# Altium project RadioTransceiverBoard.PrjPcb (part 2 of 3)

## Sheet usb_controller.SchDoc
size 381 x 228 mm; SheetNumber: 12; SheetTotal: 17
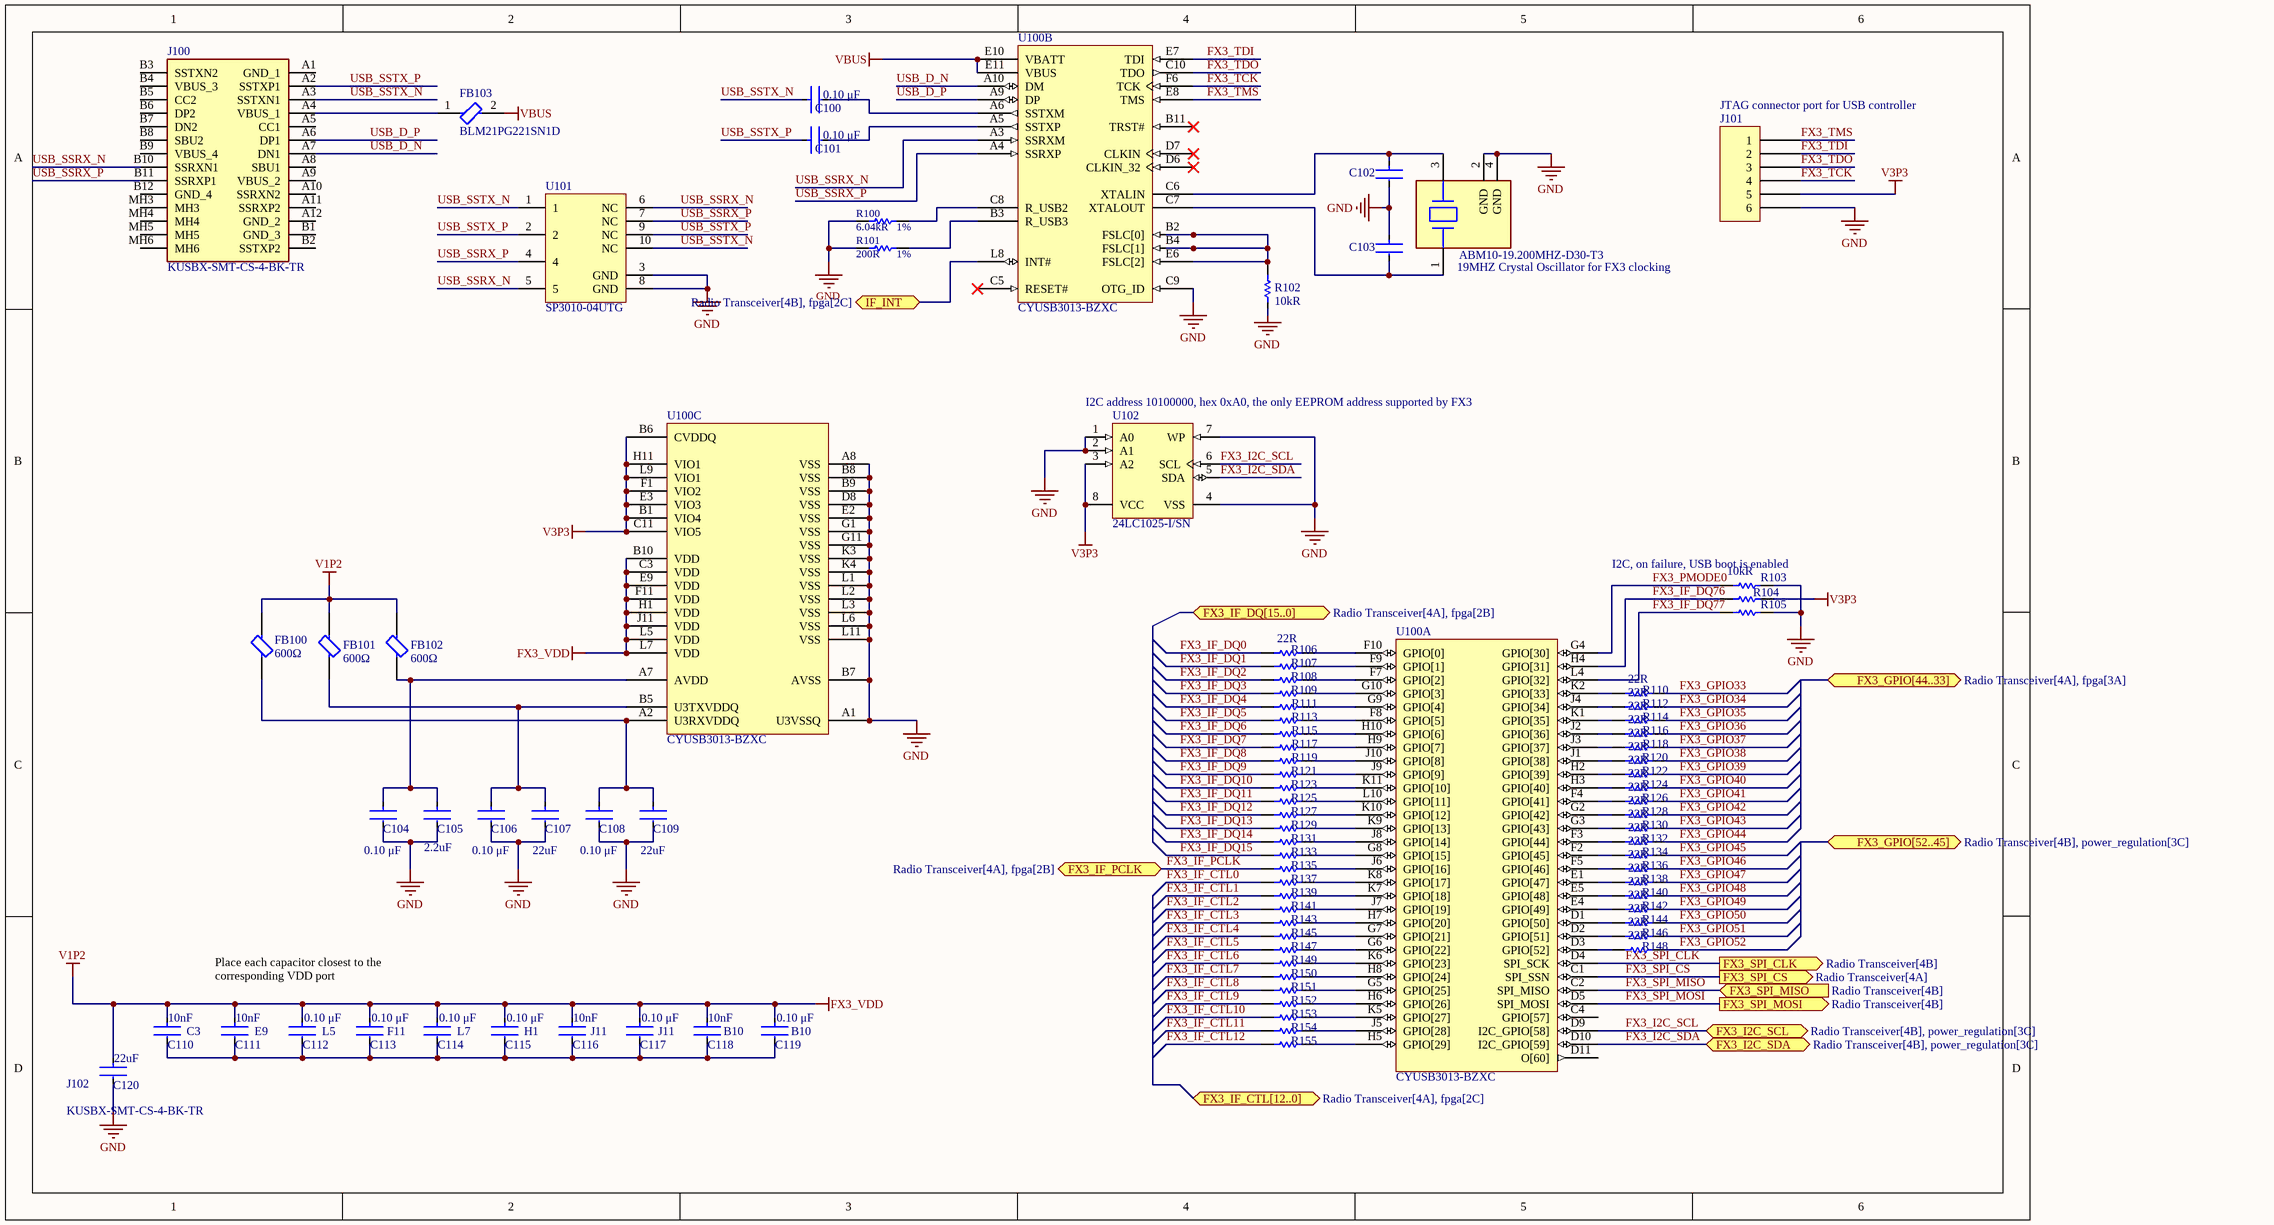
[diagram p5: usb_controller.SchDoc]

### Parts
C100  Capacitance: 0.10 μF  [FP-C0603C-CF-MFG]  (hidden comment: C0603C104K5RACTU)
C101  Capacitance: 0.10 μF  [FP-C0603C-CF-MFG]  (hidden comment: C0603C104K5RACTU)
C102  C0603C130J5GACTU  [FP-C0603C-CF-MFG]  (value not drawn)
C103  C0603C130J5GACTU  [FP-C0603C-CF-MFG]  (value not drawn)
C104  Capacitance: 0.10 μF  [FP-C0603C-CF-MFG]
C105  Capacitance: 2.2uF  [FP-0603-L_1_6_0_15-W_0_81-IPC_B]  (hidden comment: 06036C225KAT2A)
C106  Capacitance: 0.10 μF  [FP-C0603C-CF-MFG]
C107  Capacitance: 22uF  [FP-GRM21B-0_15-MFG]  (hidden comment: GRM21BR60J226ME39L)
C108  Capacitance: 0.10 μF  [FP-C0603C-CF-MFG]
C109  Capacitance: 22uF  [FP-GRM21B-0_15-MFG]  (hidden comment: GRM21BR60J226ME39L)
C110  C3  Capacitance: 10nF  [FP-GRM155-0_05-IPC_C]
C111  E9  Capacitance: 10nF  [FP-GRM155-0_05-IPC_C]
C112  L5  Capacitance: 0.10 μF  [FP-C0603C-CF-MFG]
C113  F11  Capacitance: 0.10 μF  [FP-C0603C-CF-MFG]
C114  L7  Capacitance: 0.10 μF  [FP-C0603C-CF-MFG]
C115  H1  Capacitance: 0.10 μF  [FP-C0603C-CF-MFG]
C116  J11  Capacitance: 10nF  [FP-GRM155-0_05-IPC_C]
C117  J11  Capacitance: 0.10 μF  [FP-C0603C-CF-MFG]
C118  B10  Capacitance: 10nF  [FP-GRM155-0_05-IPC_C]
C119  B10  Capacitance: 0.10 μF  [FP-C0603C-CF-MFG]
C120  Capacitance: 22uF  [FP-GRM21B-0_15-MFG]  (hidden comment: GRM21BR60J226ME39L)
FB100  Impedance: 600Ω  [FP-MPZ2012-MFG]  (hidden comment: MPZ2012S601AT000)
FB101  Impedance: 600Ω  [FP-MPZ2012-MFG]  (hidden comment: MPZ2012S601AT000)
FB102  Impedance: 600Ω  [FP-MPZ2012-MFG]  (hidden comment: MPZ2012S601AT000)
FB103  BLM21PG221SN1D  [FP-BLM21-0_2-t0_85-e0_5-IPC_B]
FX100  ABM10-19.200MHZ-D30-T3  [FP-ABM10-MFG]
J100  KUSBX-SMT-CS-4-BK-TR  [KUSBXSMTCS4BKTR]
J101  JTAG connector port for USB controller  [SULLINS NPPN061BFCN]
J102  KUSBX-SMT-CS-4-BK-TR  [KUSBXSMTCS4BKTR]
R100  value 6.04kR  Resistance Tolerance: 1%  [RESC3216X70X50LL05T20]  (hidden comment: ERJ-8ENF6041V)
R101  value 200R  Resistance Tolerance: 1%  [RESC3216X70X50LL05T20]  (hidden comment: ERJ-8ENF2000V)
R102  value 10kR  [RESC1005X40X25ML05T05]  (hidden comment: ERJ-2GEJ103X)
R103  ERJ-2GEJ103X  [RESC1005X40X25ML05T05]  (value not drawn)
R104  value 10kR  [RESC1005X40X25ML05T05]  (hidden comment: ERJ-2GEJ103X)
R105  ERJ-2GEJ103X  [RESC1005X40X25ML05T05]  (value not drawn)
R106  value 22R  [RESC0603X26X15ML03T05]  (hidden comment: ERJ1GNF22R0C)
R107  ERJ1GNF22R0C  [RESC0603X26X15ML03T05]  (value not drawn)
R108  ERJ1GNF22R0C  [RESC0603X26X15ML03T05]  (value not drawn)
R109  ERJ1GNF22R0C  [RESC0603X26X15ML03T05]  (value not drawn)
R110  value 22R  [RESC0603X26X15ML03T05]  (hidden comment: ERJ1GNF22R0C)
R111  ERJ1GNF22R0C  [RESC0603X26X15ML03T05]  (value not drawn)
R112  value 22R  [RESC0603X26X15ML03T05]  (hidden comment: ERJ1GNF22R0C)
R113  ERJ1GNF22R0C  [RESC0603X26X15ML03T05]  (value not drawn)
R114  value 22R  [RESC0603X26X15ML03T05]  (hidden comment: ERJ1GNF22R0C)
R115  ERJ1GNF22R0C  [RESC0603X26X15ML03T05]  (value not drawn)
R116  value 22R  [RESC0603X26X15ML03T05]  (hidden comment: ERJ1GNF22R0C)
R117  ERJ1GNF22R0C  [RESC0603X26X15ML03T05]  (value not drawn)
R118  value 22R  [RESC0603X26X15ML03T05]  (hidden comment: ERJ1GNF22R0C)
R119  ERJ1GNF22R0C  [RESC0603X26X15ML03T05]  (value not drawn)
R120  value 22R  [RESC0603X26X15ML03T05]  (hidden comment: ERJ1GNF22R0C)
R121  ERJ1GNF22R0C  [RESC0603X26X15ML03T05]  (value not drawn)
R122  value 22R  [RESC0603X26X15ML03T05]  (hidden comment: ERJ1GNF22R0C)
R123  ERJ1GNF22R0C  [RESC0603X26X15ML03T05]  (value not drawn)
R124  value 22R  [RESC0603X26X15ML03T05]  (hidden comment: ERJ1GNF22R0C)
R125  ERJ1GNF22R0C  [RESC0603X26X15ML03T05]  (value not drawn)
R126  value 22R  [RESC0603X26X15ML03T05]  (hidden comment: ERJ1GNF22R0C)
R127  ERJ1GNF22R0C  [RESC0603X26X15ML03T05]  (value not drawn)
R128  value 22R  [RESC0603X26X15ML03T05]  (hidden comment: ERJ1GNF22R0C)
R129  ERJ1GNF22R0C  [RESC0603X26X15ML03T05]  (value not drawn)
R130  value 22R  [RESC0603X26X15ML03T05]  (hidden comment: ERJ1GNF22R0C)
R131  ERJ1GNF22R0C  [RESC0603X26X15ML03T05]  (value not drawn)
R132  value 22R  [RESC0603X26X15ML03T05]  (hidden comment: ERJ1GNF22R0C)
R133  ERJ1GNF22R0C  [RESC0603X26X15ML03T05]  (value not drawn)
R134  value 22R  [RESC0603X26X15ML03T05]  (hidden comment: ERJ1GNF22R0C)
R135  ERJ1GNF22R0C  [RESC0603X26X15ML03T05]  (value not drawn)
R136  value 22R  [RESC0603X26X15ML03T05]  (hidden comment: ERJ1GNF22R0C)
R137  ERJ1GNF22R0C  [RESC0603X26X15ML03T05]  (value not drawn)
R138  value 22R  [RESC0603X26X15ML03T05]  (hidden comment: ERJ1GNF22R0C)
R139  ERJ1GNF22R0C  [RESC0603X26X15ML03T05]  (value not drawn)
R140  value 22R  [RESC0603X26X15ML03T05]  (hidden comment: ERJ1GNF22R0C)
R141  ERJ1GNF22R0C  [RESC0603X26X15ML03T05]  (value not drawn)
R142  value 22R  [RESC0603X26X15ML03T05]  (hidden comment: ERJ1GNF22R0C)
R143  ERJ1GNF22R0C  [RESC0603X26X15ML03T05]  (value not drawn)
R144  value 22R  [RESC0603X26X15ML03T05]  (hidden comment: ERJ1GNF22R0C)
R145  ERJ1GNF22R0C  [RESC0603X26X15ML03T05]  (value not drawn)
R146  value 22R  [RESC0603X26X15ML03T05]  (hidden comment: ERJ1GNF22R0C)
R147  ERJ1GNF22R0C  [RESC0603X26X15ML03T05]  (value not drawn)
R148  value 22R  [RESC0603X26X15ML03T05]  (hidden comment: ERJ1GNF22R0C)
R149  ERJ1GNF22R0C  [RESC0603X26X15ML03T05]  (value not drawn)
R150  ERJ1GNF22R0C  [RESC0603X26X15ML03T05]  (value not drawn)
R151  ERJ1GNF22R0C  [RESC0603X26X15ML03T05]  (value not drawn)
R152  ERJ1GNF22R0C  [RESC0603X26X15ML03T05]  (value not drawn)
R153  ERJ1GNF22R0C  [RESC0603X26X15ML03T05]  (value not drawn)
R154  ERJ1GNF22R0C  [RESC0603X26X15ML03T05]  (value not drawn)
R155  ERJ1GNF22R0C  [RESC0603X26X15ML03T05]  (value not drawn)
U100  CYUSB3013-BZXC  [CYP-BZX121]  (parts A,B,C of 3)
U101  SP3010-04UTG  [LFUS-uDFN-10_V]
U102  24LC1025-I/SN  [SOIC-SN8_L]

### Ports
FX3_GPIO[44..33] (bidir, see Radio Transceiver[4A], fpga[3A]), FX3_GPIO[52..45] (bidir, see Radio Transceiver[4B], power_regulation[3C]), FX3_I2C_SCL (bidir, see Radio Transceiver[4B], power_regulation[3C]), FX3_I2C_SDA (bidir, see Radio Transceiver[4B], power_regulation[3C]), FX3_IF_CTL[12..0] (bidir, see Radio Transceiver[4A], fpga[2C]), FX3_IF_DQ[15..0] (bidir, see Radio Transceiver[4A], fpga[2B]), FX3_IF_PCLK (bidir, see Radio Transceiver[4A], fpga[2B]), FX3_SPI_CLK (out, see Radio Transceiver[4B]), FX3_SPI_CS (out, see Radio Transceiver[4A]), FX3_SPI_MISO (in, see Radio Transceiver[4B]), FX3_SPI_MOSI (out, see Radio Transceiver[4B]), IF_INT (bidir, see Radio Transceiver[4B], fpga[2C])

### Nets
FX3_VDD: C110.1 C111.1 C112.1 C113.1 C114.1 C115.1 C116.1 C117.1 C118.1 C119.1 C120.1 FB100.2 FB101.2 FB102.2 U100.B10(VDD) U100.C3(VDD) U100.E9(VDD) U100.F11(VDD) U100.H1(VDD) U100.J11(VDD) U100.L5(VDD) U100.L7(VDD)  [also labelled V1P2]
GND: C102.2 C103.1 C104.2 C105.2 C106.2 C107.2 C108.2 C109.2 C120.2 FX100.2(GND) FX100.4(GND) J101.6 R100.1 R101.1 R102.1 R103.2 R105.2 U100.A1(U3VSSQ) U100.A8(VSS) U100.B7(AVSS) U100.B8(VSS) U100.B9(VSS) U100.C9(OTG_ID) U100.D8(VSS) U100.E2(VSS) U100.G1(VSS) U100.G11(VSS) U100.K3(VSS) U100.K4(VSS) U100.L1(VSS) U100.L2(VSS) U100.L3(VSS) U100.L6(VSS) U100.L11(VSS) U101.3(GND) U101.8(GND) U102.1(A0) U102.2(A1) U102.4(VSS) U102.7(WP)
V3P3: J101.5 R104.2 U100.B1(VIO4) U100.B6(CVDDQ) U100.C11(VIO5) U100.E3(VIO3) U100.F1(VIO2) U100.H11(VIO1) U100.L9(VIO1) U102.3(A2) U102.8(VCC)
VBUS: FB103.2 U100.E10(VBATT) U100.E11(VBUS)
FX3_GPIO33: R110.2
FX3_GPIO34: R112.2
FX3_GPIO35: R114.2
FX3_GPIO36: R116.2
FX3_GPIO37: R118.2
FX3_GPIO38: R120.2
FX3_GPIO39: R122.2
FX3_GPIO40: R124.2
FX3_GPIO41: R126.2
FX3_GPIO42: R128.2
FX3_GPIO43: R130.2
FX3_GPIO44: R132.2
FX3_GPIO45: R134.2
FX3_GPIO46: R136.2
FX3_GPIO47: R138.2
FX3_GPIO48: R140.2
FX3_GPIO49: R142.2
FX3_GPIO50: R144.2
FX3_GPIO51: R146.2
FX3_GPIO52: R148.2
FX3_I2C_SCL: U100.D9(I2C_GPIO[58]) U102.6(SCL) ; port FX3_I2C_SCL
FX3_I2C_SDA: U100.D10(I2C_GPIO[59]) U102.5(SDA) ; port FX3_I2C_SDA
FX3_IF_CTL0: R137.1
FX3_IF_CTL1: R139.1
FX3_IF_CTL2: R141.1
FX3_IF_CTL3: R143.1
FX3_IF_CTL4: R145.1
FX3_IF_CTL5: R147.1
FX3_IF_CTL6: R149.1
FX3_IF_CTL7: R150.1
FX3_IF_CTL8: R151.1
FX3_IF_CTL9: R152.1
FX3_IF_CTL10: R153.1
FX3_IF_CTL11: R154.1
FX3_IF_CTL12: R155.1
FX3_IF_DQ0: R106.1
FX3_IF_DQ1: R107.1
FX3_IF_DQ2: R108.1
FX3_IF_DQ3: R109.1
FX3_IF_DQ4: R111.1
FX3_IF_DQ5: R113.1
FX3_IF_DQ6: R115.1
FX3_IF_DQ7: R117.1
FX3_IF_DQ8: R119.1
FX3_IF_DQ9: R121.1
FX3_IF_DQ10: R123.1
FX3_IF_DQ11: R125.1
FX3_IF_DQ12: R127.1
FX3_IF_DQ13: R129.1
FX3_IF_DQ14: R131.1
FX3_IF_DQ15: R133.1
FX3_IF_DQ76: R104.1 U100.H4(GPIO[31])
FX3_IF_DQ77: R105.1 U100.L4(GPIO[32])
FX3_IF_PCLK: R135.1 ; port FX3_IF_PCLK
FX3_PMODE0: R103.1 U100.G4(GPIO[30])
FX3_SPI_CLK: U100.D4(SPI_SCK) ; port FX3_SPI_CLK
FX3_SPI_CS: U100.C1(SPI_SSN) ; port FX3_SPI_CS
FX3_SPI_MISO: U100.C2(SPI_MISO) ; port FX3_SPI_MISO
FX3_SPI_MOSI: U100.D5(SPI_MOSI) ; port FX3_SPI_MOSI
FX3_TCK: J101.4 U100.F6(TCK)
FX3_TDI: J101.2 U100.E7(TDI)
FX3_TDO: J101.3 U100.C10(TDO)
FX3_TMS: J101.1 U100.E8(TMS)
USB_D_N: J100.A7(DN1) U100.A10(DM)
USB_D_P: J100.A6(DP1) U100.A9(DP)
USB_SSRX_N: J100.B10(SSRXN1) U100.A3(SSRXM) U101.5 U101.6(NC)
USB_SSRX_P: J100.B11(SSRXP1) U100.A4(SSRXP) U101.4 U101.7(NC)
USB_SSTX_N: C100.1 J100.A3(SSTXN1) U101.1 U101.10(NC)
USB_SSTX_P: C101.1 J100.A2(SSTXP1) U101.2 U101.9(NC)
NetC100_2: C100.2 U100.A6(SSTXM)
NetC101_2: C101.2 U100.A5(SSTXP)
NetC102_1: C102.1 FX100.3 U100.C6(XTALIN)
NetC103_2: C103.2 FX100.1 U100.C7(XTALOUT)
NetC104_1: C104.1 C105.1 FB102.1 U100.A7(AVDD)
NetC106_1: C106.1 C107.1 FB101.1 U100.B5(U3TXVDDQ)
NetC108_1: C108.1 C109.1 FB100.1 U100.A2(U3RXVDDQ)
NetC110_2: C110.2 C111.2 C112.2 C113.2 C114.2 C115.2 C116.2 C117.2 C118.2 C119.2
NetFB103_1: FB103.1 J100.A4(VBUS_1)
NetIC201_P11: U100.L8(INT#) ; port IF_INT
NetR100_2: R100.2 U100.C8(R_USB2)
NetR101_2: R101.2 U100.B3(R_USB3)
NetR102_2: R102.2 U100.B2(FSLC[0]) U100.B4(FSLC[1]) U100.E6(FSLC[2])
NetR106_2: R106.2 U100.F10(GPIO[0])
NetR107_2: R107.2 U100.F9(GPIO[1])
NetR108_2: R108.2 U100.F7(GPIO[2])
NetR109_2: R109.2 U100.G10(GPIO[3])
NetR110_1: R110.1 U100.K2(GPIO[33])
NetR111_2: R111.2 U100.G9(GPIO[4])
NetR112_1: R112.1 U100.J4(GPIO[34])
NetR113_2: R113.2 U100.F8(GPIO[5])
NetR114_1: R114.1 U100.K1(GPIO[35])
NetR115_2: R115.2 U100.H10(GPIO[6])
NetR116_1: R116.1 U100.J2(GPIO[36])
NetR117_2: R117.2 U100.H9(GPIO[7])
NetR118_1: R118.1 U100.J3(GPIO[37])
NetR119_2: R119.2 U100.J10(GPIO[8])
NetR120_1: R120.1 U100.J1(GPIO[38])
NetR121_2: R121.2 U100.J9(GPIO[9])
NetR122_1: R122.1 U100.H2(GPIO[39])
NetR123_2: R123.2 U100.K11(GPIO[10])
NetR124_1: R124.1 U100.H3(GPIO[40])
NetR125_2: R125.2 U100.L10(GPIO[11])
NetR126_1: R126.1 U100.F4(GPIO[41])
NetR127_2: R127.2 U100.K10(GPIO[12])
NetR128_1: R128.1 U100.G2(GPIO[42])
NetR129_2: R129.2 U100.K9(GPIO[13])
NetR130_1: R130.1 U100.G3(GPIO[43])
NetR131_2: R131.2 U100.J8(GPIO[14])
NetR132_1: R132.1 U100.F3(GPIO[44])
NetR133_2: R133.2 U100.G8(GPIO[15])
NetR134_1: R134.1 U100.F2(GPIO[45])
NetR135_2: R135.2 U100.J6(GPIO[16])
NetR136_1: R136.1 U100.F5(GPIO[46])
NetR137_2: R137.2 U100.K8(GPIO[17])
NetR138_1: R138.1 U100.E1(GPIO[47])
NetR139_2: R139.2 U100.K7(GPIO[18])
NetR140_1: R140.1 U100.E5(GPIO[48])
NetR141_2: R141.2 U100.J7(GPIO[19])
NetR142_1: R142.1 U100.E4(GPIO[49])
NetR143_2: R143.2 U100.H7(GPIO[20])
NetR144_1: R144.1 U100.D1(GPIO[50])
NetR145_2: R145.2 U100.G7(GPIO[21])
NetR146_1: R146.1 U100.D2(GPIO[51])
NetR147_2: R147.2 U100.G6(GPIO[22])
NetR148_1: R148.1 U100.D3(GPIO[52])
NetR149_2: R149.2 U100.K6(GPIO[23])
NetR150_2: R150.2 U100.H8(GPIO[24])
NetR151_2: R151.2 U100.G5(GPIO[25])
NetR152_2: R152.2 U100.H6(GPIO[26])
NetR153_2: R153.2 U100.K5(GPIO[27])
NetR154_2: R154.2 U100.J5(GPIO[28])
NetR155_2: R155.2 U100.H5(GPIO[29])

Not connected (* = marked no-connect by the designer): J100 A1(GND_1) A5(CC1) A8(SBU1) A9(VBUS_2) A10(SSRXN2) A11(SSRXP2) A12(GND_2) B1(GND_3) B2(SSTXP2) B3(SSTXN2) B4(VBUS_3) B5(CC2) B6(DP2) B7(DN2) B8(SBU2) B9(VBUS_4) B12(GND_4) MH3 MH4 MH5 MH6; U100 A11(NC) B11(TRST#)* C4(GPIO[57]) C5(RESET#)* D6(CLKIN_32)* D7(CLKIN)* D11(O[60])

### Notes on the sheet
- (near FX100) 19MHZ Crystal Oscillator for FX3 clocking
- (near U102) I2C address 10100000, hex 0xA0, the only EEPROM address supported by FX3
- (near R103) I2C, on failure, USB boot is enabled
- Place each capacitor closest to the corresponding VDD port

### Library data of the parts
C100 C101 = CMP-2006-03061-2: CAP CER 0.1UF 50V X7R 0603; Manufacturer: KEMET; Tolerance: 0.1; Temperature Coefficient: 30ppm/°C; Material: Ceramic; Automotive Grade: Grade 1; Value: 0.10 μF; Temperature: -55°C to +125°C; RoHS: TRUE; Temperature Range High: +125°C; Lead Free: Yes; Octopart: https://octopart.com/c0603c104k5ractu-kemet-139244; Digikey Description: CAP CER 0.1UF 50V X7R 0603; Category: Cap; Package: C0603C-CF; ComponentLink2Description: Datasheet; Temperature Range Low: -55°C; Device Class L1: Passive Components; Voltage Rating: 50 V; Automotive: Yes; Device Class L3: Ceramic Capacitors; ComponentLink2URL: https://api.kemet.com/component-edge/download/datasheet/C0603C100J5GACAUTO.pdf; Device Class L2: Capacitors; Manufacturer Part Number: C0603C104K5RACTU; Temperature Characteristic: X7R; Height: 0.87mm
C102 C103 = CMP-1035-00648-3: CAP CER 13PF 50V NP0 0603; Manufacturer: KEMET; Material: Ceramic; Tolerance: 0.05; Temperature Coefficient: 30ppm/°C; Automotive Grade: Grade 1; Temperature Characteristic: C0G; Lead Free: Yes; Automotive: Yes; Capacitance: 13 pF; Value: 13 pF; Manufacturer Part Number: C0603C130J5GACTU; Mouser Description: Multilayer Ceramic Capacitor, C Series, 13 Pf, - 5%, C0g / Np0, 50 V, 0603 [1608 Metric] Rohs Compliant: Yes; Voltage Rating: 50 V; ComponentLink2URL: https://api.kemet.com/component-edge/download/datasheet/C0603C100J5GACAUTO.pdf; RoHS: TRUE; Temperature Range Low: -55°C; Octopart: https://octopart.com/c0603c130j5gactu-kemet-9139215; Device Class L1: Passive Components; Temperature: -55°C to +125°C; Package: C0603C-CF; ComponentLink2Description: Datasheet; Temperature Range High: +125°C; Device Class L2: Capacitors; Device Class L3: Ceramic Capacitors; Height: 0.87mm; Digikey Description: CAP CER 13PF 50V NP0 0603; Category: Cap
C104 C106 C108 C112-C115 C117 C119 = CMP-2006-03061-2: CAP CER 0.1UF 50V X7R 0603; Manufacturer: KEMET; Manufacturer Part Number: C0603C104K5RACTU; Tolerance: 0.1; Temperature Coefficient: 30ppm/°C; Material: Ceramic; Automotive Grade: Grade 1; Value: 0.10 μF; Temperature: -55°C to +125°C; RoHS: TRUE; Temperature Range High: +125°C; Lead Free: Yes; Octopart: https://octopart.com/c0603c104k5ractu-kemet-139244; Digikey Description: CAP CER 0.1UF 50V X7R 0603; Category: Cap; Package: C0603C-CF; ComponentLink2Description: Datasheet; Temperature Range Low: -55°C; Device Class L1: Passive Components; Voltage Rating: 50 V; Automotive: Yes; Device Class L3: Ceramic Capacitors; ComponentLink2URL: https://api.kemet.com/component-edge/download/datasheet/C0603C100J5GACAUTO.pdf; Device Class L2: Capacitors; Temperature Characteristic: X7R; Height: 0.87mm
C105 = CMP-2006-04473-2: General Purpose Ceramic Capacitor, 0603, 2.2uF, 10%, X7R, 15%, 6.3V; Dissipation Factor: 5%; Min Operating Temperature: -55°C; Dielectric: X7R; Depth: 0.81mm; Contact Plating: Tin; Termination: SMD/SMT; Voltage Rating (DC): 6.3V; RoHS Compliant: Yes; Case Code (Imperial): 0603; Lead Free: Lead Free; Packaging: Tape and Reel; Radiation Hardening: No; Max Operating Temperature: 125°C; Number of Pins: 2; Tolerance: 10%; Mount: Surface Mount; Construction: Flat; Package Quantity: 1; Case/Package: 0603; REACH SVHC: No SVHC; Length: 1.6mm; Case Code (Metric): 1608; Width: 0.032inch; Thickness: 0.035inch; Voltage: 6.3V; Height: 0.94mm; Voltage Rating: 6.3V; Series: -
C107 C109 C120 = CMP-2007-03385-2: Chip Multilayer Ceramic Capacitors for General Purpose, 0805, 22uF, X5R, 15%, 20%, 6.3V; Material: Ceramic; Max Operating Temperature: 85°C; Voltage: 6.3V; Min Operating Temperature: -55°C; Case/Package: 0805; Thickness: 0.053inch; Dielectric: X5R; Packaging: Tape and Reel; Depth: 1.25mm; Termination: SMD/SMT; Voltage Rating (DC): 6.3V; Radiation Hardening: No; Tolerance: 20%; Mount: Surface Mount; Lead Free: Lead Free; Package Quantity: 1; REACH SVHC: No SVHC; Voltage Rating: 6.3V; Length: 2mm; Case Code (Imperial): 0805; Case Code (Metric): 2012; Width: 0.049inch; Height: 1.25mm
C110 C111 C116 C118 = CMP-2008-04637-5: Chip Multilayer Ceramic Capacitors for General Purpose, 0402, 10000pF, X7R, 15%, 10%, 50V; Voltage: 25V; Tolerance: 10%; Mount: Surface Mount; Lead Free: Lead Free; Radiation Hardening: No; Case Code (Imperial): 0402; REACH SVHC: No SVHC; Case/Package: 0402; Dielectric: X7R; Voltage Rating (DC): 50V; Max Operating Temperature: 125°C; Termination: SMD/SMT; Material: Ceramic; Width: 0.02inch; Package Quantity: 1; Voltage Rating: 50V; Thickness: 0.022inch; Packaging: Tape and Reel; Height: 0.5mm; Number of Pins: 2; Case Code (Metric): 1005; Min Operating Temperature: -55°C; Length: 1mm; Depth: 0.5mm
FB100-FB102 = CMP-2000-05401-2: Manufacturer Lifecycle Status: PRODUCTION; NexarPartId: 12090955; RMS Current (Irms): 2A; Test Frequency: 100MHz; Tolerance: 25%; Core Material: Ferrite; Series Resistance: 100mΩ; Packaging: Digi-Reel®; Length: 2mm; Min Operating Temperature: -55°C; Width: 1.25mm; Max Width: 1.45mm; Lead Free: Lead Free; Current Rating: 2A; Case Code (Imperial): 0805; Min Length: 1.8mm; Schedule B: 8504500000, 8504500000; REACH SVHC: No SVHC; Case Code (Metric): 2012; Max DC Current: 2A; Case/Package: 0805; Lifecycle Status: Production; Min Width: 1.05mm; Mount: Surface Mount; Height: 1.0414mm; Resistance: 100mΩ; DC Resistance (DCR): 100mΩ; Max Operating Temperature: 125°C; Max Length: 2.2mm; RoHS: Compliant
FB103 = CMP-0686-00610-3: Chip Ferrite Bead, 0805, 220Ω @ 100MHz, 0.045Ω, 25%, 2A; Number of Circuits: 1; Shielding: Unshielded; DC Resistance (DCR): 45mR; Impedance: 220R; Radiation Hardening: No; Material: Ferrite; Frequency: 100MHz; Width: 1.25mm; DC Current: 2A; Max DC Current: 2A; Number of Lines: 1; Package Quantity: 1; Case Code (Metric): 2012; Current Rating: 2A; Case/Package: 0805; Current: 2A; Military Standard: Not; Core Material: Ferrite; Depth: 1.25mm; Contact Plating: Tin; DC Resistance-Max: 45mR; Max Operating Temperature: 125°C; Length: 2mm; Max Current Rating: 2A; REACH SVHC: No SVHC; Termination: SMD/SMT; Min Operating Temperature: -55°C; Series: BLM21P; Test Frequency: 100MHz; Tolerance: 25%; Number of Pins: 2; RoHS Compliant: Yes; Height: 0.85mm; Packaging: Tape and Reel; Lead Free: Lead Free; Case Code (Imperial): 0805
FX100 = CMP-27762-005233-1: Crystal 19.2MHz ±20ppm 10pF SMD-4 2.5mm x 2mm; ESR (Equivalent Series Resistance): 150R; Frequency Stability: 30ppm; Case/Package: SMD/SMT; Package Quantity: 3000; Tolerance: 20ppm; Termination: SMD/SMT; Frequency: 19.2MHz; Frequency Tolerance: 20ppm; Packaging: Tape and Reel; Max Operating Temperature: 85°C; Height: 0.028inch; Load Capacitance: 10pF; REACH SVHC: No SVHC; Series: ABM10; Number of Pins: 4; Length: 2.5mm; Width: 0.079inch; Mount: Surface Mount; Min Operating Temperature: -40°C; Depth: 2mm
J100 J102 = KUSBX-SMT-CS-4-BK-TR: Connector; Manufacturer_Name: Kycon; Datasheet Link: https://www.kycon.com/Pub_Eng_Draw/KUSBX-SMT-CS-4-BK-xxTR.pdf; Height: 3.56mm; Manufacturer_Part_Number: KUSBX-SMT-CS-4-BK-TR; Mouser Part Number: 806-KUSBX-SMTCS4BKTR; Mouser Price/Stock: https://www.mouser.co.uk/ProductDetail/Kycon/KUSBX-SMT-CS-4-BK-TR?qs=vvQtp7zwQdMngGj1HUt%252BlA%3D%3D
J101 = NPPN061BFCN-RC: CONN HDR 6POS 0.079 GOLD PCB; Manufacturer: Sullins Connector Solutions; Connector Type: Header; Contact Length - Post: 0.094" (2.40mm); Current Rating (Amps): 2A; Material Flammability Rating: UL94 V-0; Number of Positions: 6; Number of Positions Loaded: All; Pitch - Mating: 0.079" (2.00mm); Style: Board to Board; Part Number: NPPN061BFCN-RC; ComponentLink1Description: Datasheet; ComponentLink1URL: https://drawings-pdf.s3.amazonaws.com/10483.pdf; ComponentLink2Description: DigiKey Link; ComponentLink2URL: https://www.digikey.com/en/products/detail/sullins-connector-solutions/NPPN061BFCN-RC/804808; Contact Finish - Mating: Gold; Contact Finish - Post: Gold; Contact Finish Thickness - Mating: Flash; Contact Type: Female Socket; Fastening Type: Push-Pull; Insulation Color: Black; Insulation Height: 0.173" (4.40mm); LastUpdated: 6/21/2022 2:43:22 PM; Lifecycle Status: Active; Minimum Order: 1; Mounting Type: Through Hole; Number of Rows: 1; Operating Temperature: -40°C ~ 105°C; Packaging: Tube; Part Status: Active; Price: 0.40; Series: -; Supplier 1: DigiKey; Supplier Part Number 1: S5751-06-ND; Termination: Solder
R100 = CMP-2003-00441-1: Manufacturer: Panasonic; Part Number: ERJ-8ENF6041V
R101 = CMP-2003-00194-1: Manufacturer: Panasonic; Part Number: ERJ-8ENF2000V
R102-R105 = CMP-2002-00433-1: Manufacturer: Panasonic; Part Number: ERJ-2GEJ103X
R106-R155 = CMP-2004-03488-1: Manufacturer: Panasonic; Part Number: ERJ1GNF22R0C
U100 = CMP-0967-00036-1: EZ-USB(R) FX3: SuperSpeed USB Controller, 512 KB, 60 I/Os, 0 to 70 degC, 121-Pin BGA (BZX121); Manufacturer: Cypress; Memory Size (KB): 512; CPU Core: ARM926 EJ-S; Min. Operating Voltage (V): 1.15; Memory Architecture: SRAM; No. of I/Os: 60; Max. Operating Voltage (V): 1.25; Code_JEDEC: PUB 95; ComponentLink1Description: Manufacturer URL; PackageDescription: 121-Ball FBGA, Body 10 x 10 mm, Pitch 0.8 mm; PackageVersion: Rev. *D; ComponentLink1URL: http://www.cypress.com/; DatasheetVersion: Rev. *O; PartNumber: CYUSB3013-BZXC; PackageReference: BZX121; Min. Operating Temp. (degreesC): 0; Max. Operating Temp. (degreesC): 70; ComponentLink3URL: http://www.cypress.com/?docID=45795; ComponentLink3Description: Package Specification; ComponentLink2URL: http://www.cypress.com/?docID=49087; ComponentLink2Description: Datasheet; RoHS: Pb-Free; Mounting Technology: Surface Mount
U101 = CMP-2000-07135-1: Low Capacitance ESD Protection, 6 V, 3 A, -40 to 125 degC, 10-Pin uDFN, RoHS, Tape and Reel; Cd - Diode Capacitance: 0.45pF; Peak Surge Current: 3A; Breakdown Voltage: 6V; Brand: Littelfuse; Polarity: Bidirectional; Number of Channels: 4Channel; Clamping Voltage: 12.3V; Packaging: Reel; Product Category: TVSDiodeArrays; Package Reference: uDFN-10; Package / Case: uDFN-10; Termination Style: SMD/SMT; Mounting Style: SMD/SMT; Minimum Operating Temperature: -55C; Mounting Technology: SurfaceMount; Width: 1mm; Tradename: SPA; Manufacturer: Littelfuse; Manufacturer URL: http://www.littelfuse.com/; Datasheet URL: http://www.littelfuse.com/~/media/electronics/datasheets/tvs_diode_arrays/littelfuse_tvs_diode_array_sp3010_datasheet.pdf.pdf; Height: 0.515mm; Package Description: 10-Pin Dual Flat Package, Body 2.5 x 1 mm, Pitch 0.5 mm; Length: 2.5mm; Type: LowCapacitanceESDProtection; RoHS: True; Working Voltage: 6V; Datasheet Version: 12/2013; Series: SP3010; Maximum Operating Temperature: +125C
U102 = CMP-0159-00339-1: 1 Mbit, 400kHz, 2.5V, 8-Pin SOIC 150mil, Industrial Temperature; PackageVersion: revBB, Aug-2009; PackageDescription: 8-Lead Plastic Small Outline (SN) - Narrow, 3.90mm Body [SOIC]; PackageReference: SOIC-SN8; Code_JEDEC: MS-012; DatasheetVersion: revF, Oct-2008; Code_IPC: SOIC127P600-8

## Sheet power_regulation.SchDoc
size 381 x 241 mm; SheetNumber: 17; SheetTotal: 17
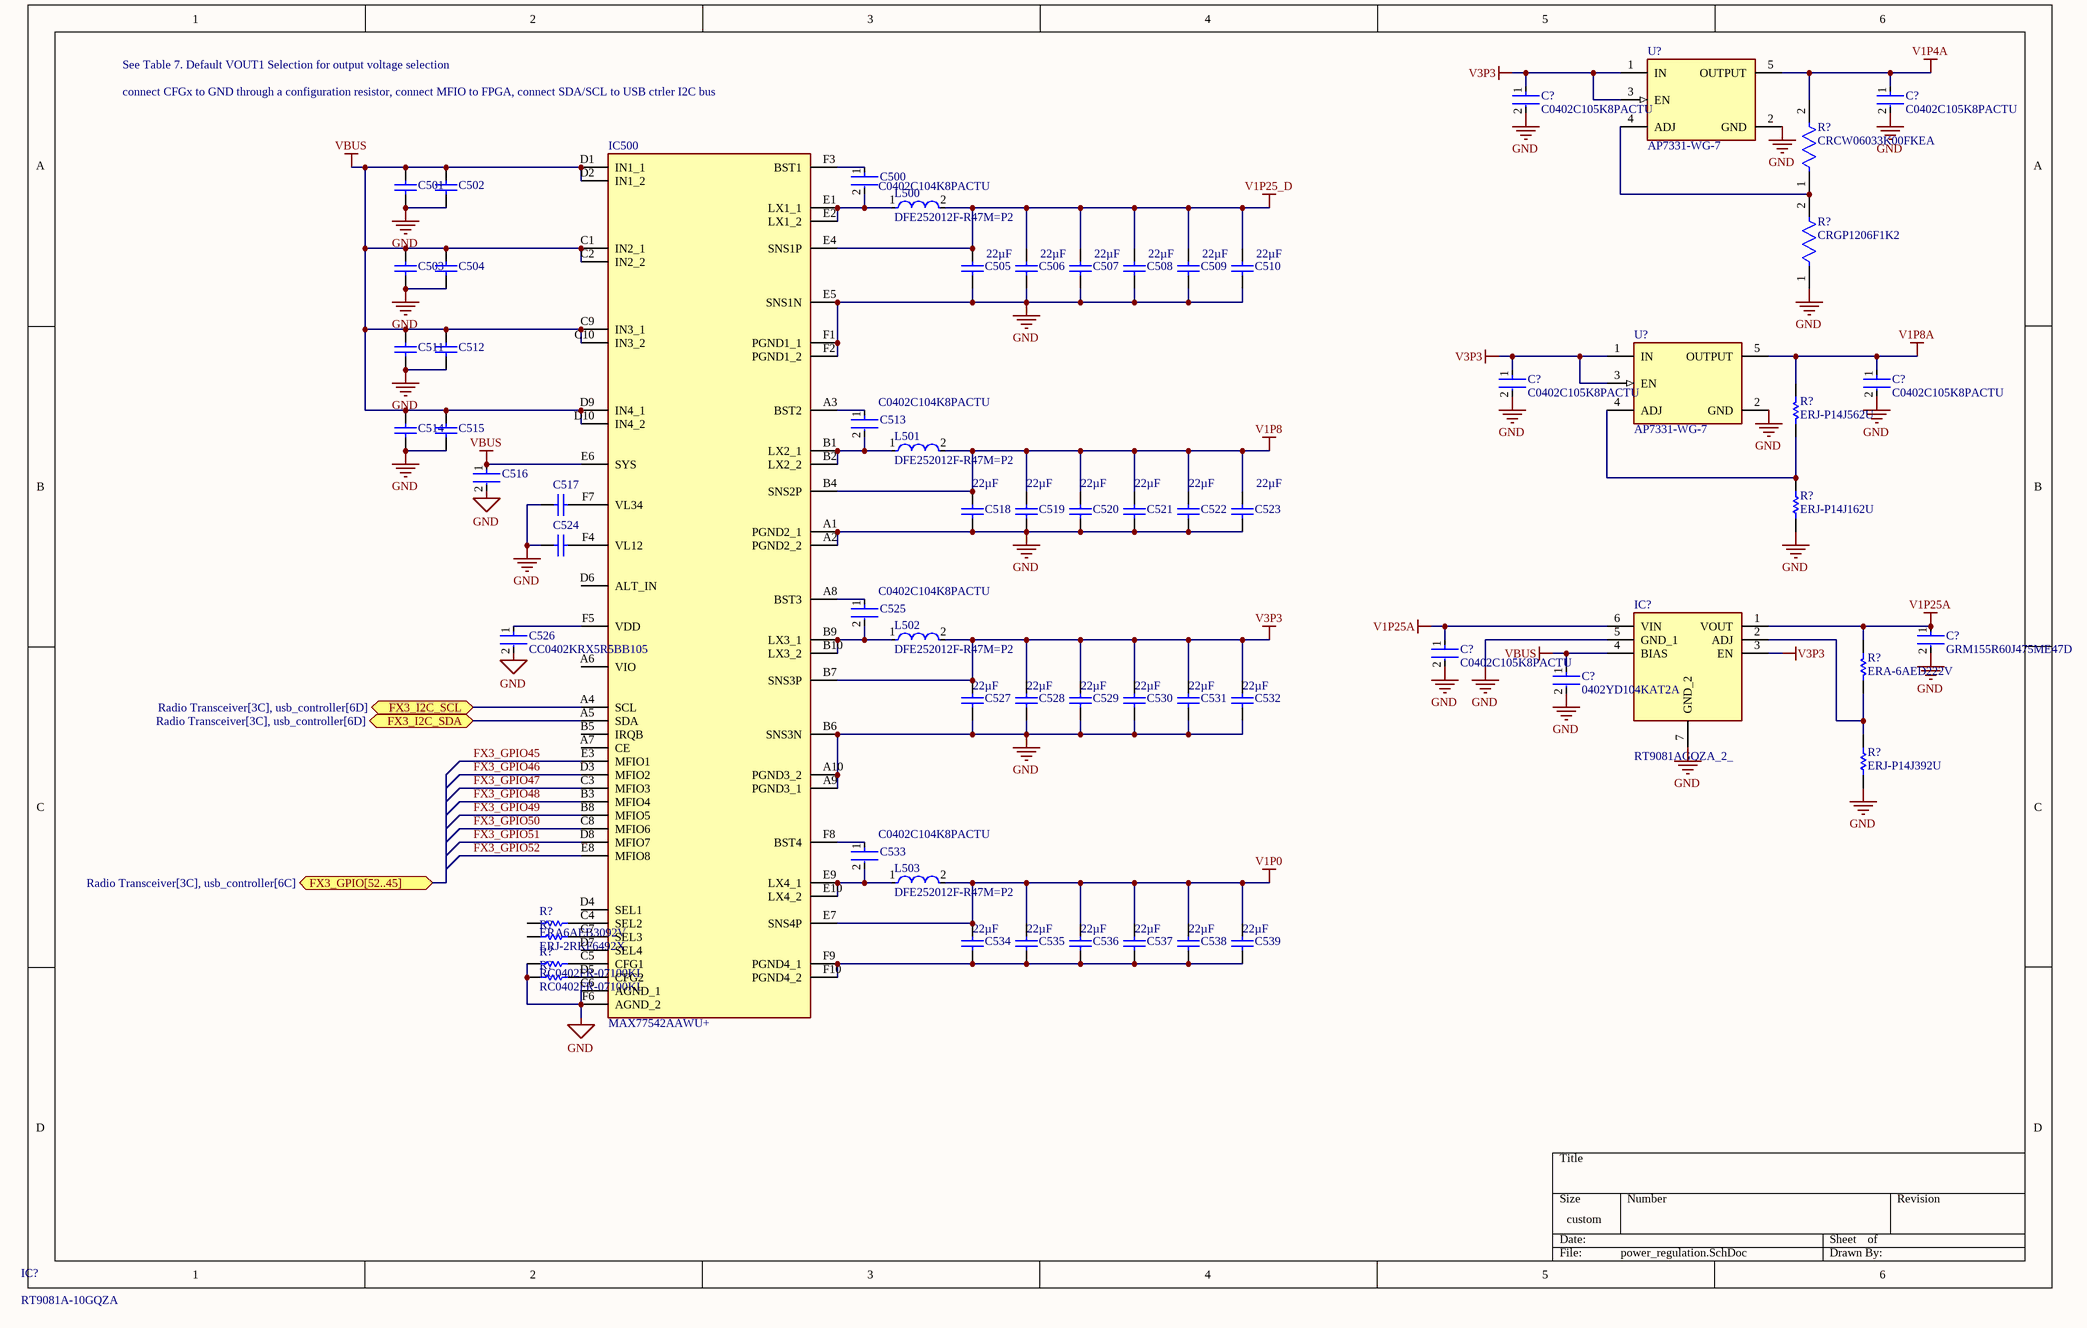
[diagram p6: power_regulation.SchDoc]

### Parts
(Parts that share a designator on the sheet are numbered #1, #2 ... from top to bottom, then left to right.)
C500  C0402C104K8PACTU  [FP-C0402-BB-MFG]
C501  C0603C105K3RACTU  [CAPC1608X87X35LL15T15]  (value not drawn)
C502  C0603C105K3RACTU  [CAPC1608X87X35LL15T15]  (value not drawn)
C503  C0603C105K3RACTU  [CAPC1608X87X35LL15T15]  (value not drawn)
C504  C0603C105K3RACTU  [CAPC1608X87X35LL15T15]  (value not drawn)
C505  Capacitance: 22µF  [CAPC1608X100X20ML10]  (hidden comment: C1608X5R1A226M080AC)
C506  Capacitance: 22µF  [CAPC1608X100X20ML10]  (hidden comment: C1608X5R1A226M080AC)
C507  Capacitance: 22µF  [CAPC1608X100X20ML10]  (hidden comment: C1608X5R1A226M080AC)
C508  Capacitance: 22µF  [CAPC1608X100X20ML10]  (hidden comment: C1608X5R1A226M080AC)
C509  Capacitance: 22µF  [CAPC1608X100X20ML10]  (hidden comment: C1608X5R1A226M080AC)
C510  Capacitance: 22µF  [CAPC1608X100X20ML10]  (hidden comment: C1608X5R1A226M080AC)
C511  C0603C105K3RACTU  [CAPC1608X87X35LL15T15]  (value not drawn)
C512  C0603C105K3RACTU  [CAPC1608X87X35LL15T15]  (value not drawn)
C513  C0402C104K8PACTU  [FP-C0402-BB-MFG]
C514  C0603C105K3RACTU  [CAPC1608X87X35LL15T15]  (value not drawn)
C515  C0603C105K3RACTU  [CAPC1608X87X35LL15T15]  (value not drawn)
C516  GRT155R61E225KE13D  [FP-GRT155-0_2-IPC_C]  (value not drawn)
C517  C0402C225K9PACTU  [CAPC1005X60X30NL05T10]  (value not drawn)
C518  Capacitance: 22µF  [CAPC1608X100X20ML10]  (hidden comment: C1608X5R1A226M080AC)
C519  Capacitance: 22µF  [CAPC1608X100X20ML10]  (hidden comment: C1608X5R1A226M080AC)
C520  Capacitance: 22µF  [CAPC1608X100X20ML10]  (hidden comment: C1608X5R1A226M080AC)
C521  Capacitance: 22µF  [CAPC1608X100X20ML10]  (hidden comment: C1608X5R1A226M080AC)
C522  Capacitance: 22µF  [CAPC1608X100X20ML10]  (hidden comment: C1608X5R1A226M080AC)
C523  Capacitance: 22µF  [CAPC1608X100X20ML10]  (hidden comment: C1608X5R1A226M080AC)
C524  C0402C225K9PACTU  [CAPC1005X60X30NL05T10]  (value not drawn)
C525  C0402C104K8PACTU  [FP-C0402-BB-MFG]
C526  CC0402KRX5R5BB105  [FP-CC0402-MFG]
C527  Capacitance: 22µF  [CAPC1608X100X20ML10]  (hidden comment: C1608X5R1A226M080AC)
C528  Capacitance: 22µF  [CAPC1608X100X20ML10]  (hidden comment: C1608X5R1A226M080AC)
C529  Capacitance: 22µF  [CAPC1608X100X20ML10]  (hidden comment: C1608X5R1A226M080AC)
C530  Capacitance: 22µF  [CAPC1608X100X20ML10]  (hidden comment: C1608X5R1A226M080AC)
C531  Capacitance: 22µF  [CAPC1608X100X20ML10]  (hidden comment: C1608X5R1A226M080AC)
C532  Capacitance: 22µF  [CAPC1608X100X20ML10]  (hidden comment: C1608X5R1A226M080AC)
C533  C0402C104K8PACTU  [FP-C0402-BB-MFG]
C534  Capacitance: 22µF  [CAPC1608X100X20ML10]  (hidden comment: C1608X5R1A226M080AC)
C535  Capacitance: 22µF  [CAPC1608X100X20ML10]  (hidden comment: C1608X5R1A226M080AC)
C536  Capacitance: 22µF  [CAPC1608X100X20ML10]  (hidden comment: C1608X5R1A226M080AC)
C537  Capacitance: 22µF  [CAPC1608X100X20ML10]  (hidden comment: C1608X5R1A226M080AC)
C538  Capacitance: 22µF  [CAPC1608X100X20ML10]  (hidden comment: C1608X5R1A226M080AC)
C539  Capacitance: 22µF  [CAPC1608X100X20ML10]  (hidden comment: C1608X5R1A226M080AC)
C?#1  C0402C105K8PACTU  [FP-C0402C105K8PACTU-MFG]
C?#2  C0402C105K8PACTU  [FP-C0402C105K8PACTU-MFG]
C?#3  C0402C105K8PACTU  [FP-C0402C105K8PACTU-MFG]
C?#4  C0402C105K8PACTU  [FP-C0402C105K8PACTU-MFG]
C?#5  GRM155R60J475ME47D  [FP-GRM155-0_1-IPC_B]
C?#6  C0402C105K8PACTU  [FP-C0402C105K8PACTU-MFG]
C?#7  0402YD104KAT2A  [FP-0402-L_1_0_1-W_0_5_0_1-IPC_B]
IC500  MAX77542AAWU+  [BGA60C40P10X6_436X256X69]
IC?#1  RT9081AGQZA_2_  [SON40P120X120X32-7N-D]
IC?#2  RT9081A-10GQZA  [SON40P120X120X32-7N-D]
L500  DFE252012F-R47M=P2  [FP-DFE252012C-MFG]
L501  DFE252012F-R47M=P2  [FP-DFE252012C-MFG]
L502  DFE252012F-R47M=P2  [FP-DFE252012C-MFG]
L503  DFE252012F-R47M=P2  [FP-DFE252012C-MFG]
R?#1  CRCW06033K00FKEA  [FP-CRCW0603-e3-MFG]
R?#2  CRGP1206F1K2  [FP-CRGP1206-IPC_C]
R?#3  ERJ-P14J562U  [RESC3225X70X50ML20T20]
R?#4  ERJ-P14J162U  [RESC3225X70X50NL20T20]
R?#5  ERA-6AED222V  [RESC2013X60X40NL20T25]
R?#6  ERJ-P14J392U  [RESC3225X70X50LL20T20]
R?#7  ERA6AEB3092V  [RESC2013X60X40NL20T25]
R?#8  ERJ-2RKF6492X  [RESC1005X40X25ML05T05]
R?#9  RC0402FR-07100KL  [RESC1005X40X25NL05T10]
R?#10  RC0402FR-07100KL  [RESC1005X40X25NL05T10]
U?#1  AP7331-WG-7  [FP-SOT25-MFG]
U?#2  AP7331-WG-7  [FP-SOT25-MFG]

### Ports
FX3_GPIO[52..45] (bidir, see Radio Transceiver[3C], usb_controller[6C]), FX3_I2C_SCL (bidir, see Radio Transceiver[3C], usb_controller[6D]), FX3_I2C_SDA (bidir, see Radio Transceiver[3C], usb_controller[6D])

### Nets
GND: C501.1 C502.1 C503.1 C504.1 C505.1 C506.1 C507.1 C508.1 C509.1 C510.1 C511.1 C512.1 C514.1 C515.1 C516.2 C517.1 C518.1 C519.1 C520.1 C521.1 C522.1 C523.1 C524.1 C526.2 C527.1 C528.1 C529.1 C530.1 C531.1 C532.1 C?#1.2 C?#2.2 C?#3.2 C?#4.2 C?#5.2 C?#6.2 C?#7.2 IC500.A1(PGND2_1) IC500.A2(PGND2_2) IC500.A9(PGND3_1) IC500.A10(PGND3_2) IC500.B6(SNS3N) IC500.C6(AGND_1) IC500.E5(SNS1N) IC500.F1(PGND1_1) IC500.F2(PGND1_2) IC500.F6(AGND_2) IC?#1.5(GND_1) IC?#1.7(GND_2) R?#2.1 R?#4.1 R?#6.1 R?#9.1 R?#10.1 U?#1.2(GND) U?#2.2(GND)
V1P0: C534.2 C535.2 C536.2 C537.2 C538.2 C539.2 IC500.E7(SNS4P) L503.2
V1P4A: C?#2.1 R?#1.2 U?#1.5(OUTPUT)
V1P8: C518.2 C519.2 C520.2 C521.2 C522.2 C523.2 IC500.B4(SNS2P) L501.2
V1P8A: C?#4.1 R?#3.1 U?#2.5(OUTPUT)
V1P25_D: C505.2 C506.2 C507.2 C508.2 C509.2 C510.2 IC500.E4(SNS1P) L500.2  [project net Vin_C_1P25D]
V1P25A: C?#5.1 C?#6.1 IC?#1.1(VOUT) IC?#1.6(VIN) R?#5.1  [project net Vin_B_1P25A]
V3P3: C527.2 C528.2 C529.2 C530.2 C531.2 C532.2 C?#1.1 C?#3.1 IC500.B7(SNS3P) IC?#1.3(EN) L502.2 U?#1.1(IN) U?#1.3(EN) U?#2.1(IN) U?#2.3(EN)
VBUS: C501.2 C502.2 C503.2 C504.2 C511.2 C512.2 C514.2 C515.2 C516.1 C?#7.1 IC500.C1(IN2_1) IC500.C2(IN2_2) IC500.C9(IN3_1) IC500.C10(IN3_2) IC500.D1(IN1_1) IC500.D2(IN1_2) IC500.D9(IN4_1) IC500.D10(IN4_2) IC500.E6(SYS) IC?#1.4(BIAS)
FX3_GPIO45: IC500.E3(MFIO1)
FX3_GPIO46: IC500.D3(MFIO2)
FX3_GPIO47: IC500.C3(MFIO3)
FX3_GPIO48: IC500.B3(MFIO4)
FX3_GPIO49: IC500.B8(MFIO5)
FX3_GPIO50: IC500.C8(MFIO6)
FX3_GPIO51: IC500.D8(MFIO7)
FX3_GPIO52: IC500.E8(MFIO8)
FX3_I2C_SCL: IC500.A4(SCL) ; port FX3_I2C_SCL
FX3_I2C_SDA: IC500.A5(SDA) ; port FX3_I2C_SDA
NetC500_1: C500.1 IC500.F3(BST1)
NetC500_2: C500.2 IC500.E1(LX1_1) IC500.E2(LX1_2) L500.1
NetC513_1: C513.1 IC500.A3(BST2)
NetC513_2: C513.2 IC500.B1(LX2_1) IC500.B2(LX2_2) L501.1
NetC517_2: C517.2 IC500.F7(VL34)
NetC524_2: C524.2 IC500.F4(VL12)
NetC525_1: C525.1 IC500.A8(BST3)
NetC525_2: C525.2 IC500.B9(LX3_1) IC500.B10(LX3_2) L502.1
NetC526_1: C526.1 IC500.F5(VDD)
NetC533_1: C533.1 IC500.F8(BST4)
NetC533_2: C533.2 IC500.E9(LX4_1) IC500.E10(LX4_2) L503.1
NetC534_1: C534.1 C535.1 C536.1 C537.1 C538.1 C539.1 IC500.F9(PGND4_1) IC500.F10(PGND4_2)
NetIC500_C4: IC500.C4(SEL2) R?#7.2
NetIC500_C5: IC500.C5(CFG1) R?#9.2
NetIC500_C7: IC500.C7(SEL3) R?#8.2
NetIC500_D5: IC500.D5(CFG2) R?#10.2
NetIC?#1_2: IC?#1.2(ADJ) R?#5.2 R?#6.2
NetR?#1_1: R?#1.1 R?#2.2 U?#1.4(ADJ)
NetR?#3_2: R?#3.2 R?#4.2 U?#2.4(ADJ)

Not connected (* = marked no-connect by the designer): IC500 A6(VIO) A7(CE) B5(IRQB) D4(SEL1) D6(ALT_IN) D7(SEL4); R?#7 1; R?#8 1

### Notes on the sheet
- connect CFGx to GND through a configuration resistor, connect MFIO to FPGA, connect SDA/SCL to USB ctrler I2C bus
- See Table 7. Default VOUT1 Selection for output voltage selection

### Library data of the parts
C500 = CMP-2008-02046-2: CAP CER 0.1UF 10V X5R 0402; Manufacturer: Kemet; Material: Ceramic; Capacitance: 0.10 μF; Temperature Coefficient: 15%; Tolerance: 0.1; Value: 1p; Package: C0402-BB; Temperature: -55°C to +125°C; ComponentLink2Description: Datasheet; Temperature Characteristic: X5R; Device Class L1: Passive Components; Height: 0.55mm; Lead Free: Yes; ComponentLink2URL: https://content.kemet.com/datasheets/KEM_C1002_X7R_SMD.pdf; Device Class L2: Capacitors; Temperature Range Low: -55°C; Temperature Range High: +125°C; RoHS: TRUE; Octopart: https://octopart.com/c0402c104k8pactu-kemet-140039; Automotive: No; Mouser Description: Capacitor 100 nF 10 VDC 0402; Category: Cap; Voltage Rating: 10 V; Digikey Description: CAP CER 0.1UF 10V X5R 0402; Ipc Land Pattern Name: CAPC10050X50; Device Class L3: Ceramic Capacitors; Manufacturer Part Number: C0402C104K8PACTU
C501-C504 C511 C512 C514 C515 = CMP-2006-03713-1: Manufacturer: Kemet; Part Number: C0603C105K3RACTU
C505-C510 C518-C523 C527-C532 C534-C539 = CMP-2000-05441-1: Chip Capacitor, 22 uF, +/- 20%, 10 V, -55 to 85 degC, 0603 (1608 Metric), RoHS, Tape and Reel; Manufacturer: TDK; PCN Part Number: MLCCPartNumberChange30/Nov/2012; Voltage - Rated: 10V; Product Training Modules: CSeriesGeneralApplicationsSEAT,CCV,andTVCLDesignToolsGuidetoReplacinganElectrolyticCapacitorwithanMLCC; Other Names: 445-9077-1; Design Resources: 20WNon-IsolatedBuckLEDDriverUsingPLLNK460KG; Online Catalog: CSeries,GeneralPurpose; Temperature Coefficient: X5R; Kits: 445-9014-KIT-ND-KITMLCC100PF-22UF060310-50V; Value: 22µF; Packaging: CutTape(CT); Standard Package: 1; Package / Case: 0603(1608Metric); Lead Style: -; Features: -; Ratings: -; Operating Temperature: -55degC~85degC; Applications: GeneralPurpose; Package Reference: 603; Datasheet URL: http://download.siliconexpert.com/pdfs/2015/4/21/15/54/45/779/tdk_/manual/37024850441143360mlcc_commercial_general_en.pdf; Datasheet Version: Mar-15; Mounting Type: SurfaceMount,MLCC; Lead Spacing: -; Size / Dimension: 0.063"Lx0.031"W(1.60mmx0.80mm); Height - Seated (Max): -; Package Description: 2-Pin Surface Mount Device, Body 1.6 x 0.8 mm; Manufacturer URL: http://www.tdk.com/; RoHS Information: RoHSCertificate-MLCC; Tolerance: ±20%; Series: C; Thickness (Max): 0.035"(0.90mm); Family: CeramicCapacitors; Category: Capacitors
C513 C525 C533 = CMP-2008-02046-2: CAP CER 0.1UF 10V X5R 0402; Manufacturer: Kemet; Material: Ceramic; Capacitance: 0.10 μF; Temperature Coefficient: 15%; Tolerance: 0.1; Value: 0.10 μF; Package: C0402-BB; Temperature: -55°C to +125°C; ComponentLink2Description: Datasheet; Temperature Characteristic: X5R; Device Class L1: Passive Components; Height: 0.55mm; Lead Free: Yes; ComponentLink2URL: https://content.kemet.com/datasheets/KEM_C1002_X7R_SMD.pdf; Device Class L2: Capacitors; Temperature Range Low: -55°C; Temperature Range High: +125°C; RoHS: TRUE; Octopart: https://octopart.com/c0402c104k8pactu-kemet-140039; Automotive: No; Mouser Description: Capacitor 100 nF 10 VDC 0402; Category: Cap; Voltage Rating: 10 V; Digikey Description: CAP CER 0.1UF 10V X5R 0402; Ipc Land Pattern Name: CAPC10050X50; Device Class L3: Ceramic Capacitors; Manufacturer Part Number: C0402C104K8PACTU
C516 = CMP-06035-059281-1: Multi-Layer Ceramic Capacitor 2.2uF 25V X5R ±10% 0402 Paper T/R; Max Operating Temperature: 85°C; Case Code (Imperial): 0402; Width: 0.02inch; Min Operating Temperature: -55°C; Voltage Rating (DC): 25V; Tolerance: 10%; Length: 0.039inch; Ratings: AEC-Q200; Dielectric: X5R; Case Code (Metric): 1005; Thickness: 0.022inch; Voltage Rating: 25V; Packaging: Cut Tape; Case/Package: 0402; Mount: Surface Mount; Capacitance: 2.2uF; Value: 2.2uF
C517 C524 = CMP-2008-02055-1: Manufacturer: Kemet; Part Number: C0402C225K9PACTU
C526 = CMP-2100-03591-2: CAP CER 1UF 6.3V X5R 0402; Manufacturer: YAGEO; Automotive Grade: NA; Material: Ceramic; Tolerance: 0.1; Temperature Coefficient: 30ppm/°C; Voltage Rating: 6.3 V; Temperature Range Low: -55°C; Digikey Description: CAP CER 1UF 6.3V X5R 0402; Capacitance: 1 uF; Height: 0.55mm; Automotive: No; ComponentLink2URL: http://www.yageo.com/documents/recent/UPY-GP_NP0_16V-to-50V_16.pdf; Device Class L2: Capacitors; RoHS: TRUE; Temperature Range High: +125°C; Device Class L3: Ceramic Capacitors; Device Class L1: Passive Components; Temperature Characteristic: X5R; Package: CC0402; Octopart: https://octopart.com/cc0402krx5r5bb105-yageo-42244618; ComponentLink2Description: Datasheet; Temperature: -55°C to +125°C; Manufacturer Part Number: CC0402KRX5R5BB105; Mouser Description: Multilayer Ceramic Capacitors MLCC - SMD/SMT 1uF 6.3V X5R 10%; Category: Cap; Footprint Url: http://www.yageo.com/exep/pages/download/literatures/UPY-C_GEN_24.pdf; Lead Free: Yes; Ipc Land Pattern Name: CAPC10050X50; Value: 1 uF
C?#1-C?#4 C?#6 = CMP-2008-02081-2: CAP CER 1UF 10V X5R 0402; Dielectric Material: Ceramic; Dissipation Factor: 5%; Tolerance: 10%; Number of Pins: 2; Contact Plating: Tin; Min Operating Temperature: -55°C; Termination: SMD/SMT; Lead Free: Lead Free; Construction: Flat; Voltage Rating (DC): 10V; Mount: Surface Mount; Series: C; Thickness: 0.022inch; Width: 0.5mm; Radiation Hardening: No; Capacitance: 1uF; Dielectric: X5R; Height: 0.5mm; Voltage: 10V; Length: 1mm; Depth: 0.5mm; Max Operating Temperature: 85°C; Package Quantity: 1; Packaging: Tape and Reel; RoHS Compliant: Yes; Case Code (Imperial): 0402; Case Code (Metric): 1005; REACH SVHC: No SVHC; Voltage Rating: 10V; Case/Package: 0402
C?#5 = CMP-2008-04549-2: Chip Multilayer Ceramic Capacitors for General Purpose, 0402, 4.7uF, X5R, 15%, 20%, 6.3V; Height: 0.5mm; Weight: 0.000212oz; Length: 1mm; Case Code (Metric): 1005; Packaging: Tape and Reel; Termination: SMD/SMT; Dielectric: X5R; Depth: 0.5mm; Case Code (Imperial): 0402; Min Operating Temperature: -55°C; Case/Package: 0402; Voltage: 6.3V; Width: 0.02inch; Capacitance: 4.7uF; Lead Free: Lead Free; Thickness: 0.022inch; Contact Plating: Tin; REACH SVHC: No SVHC; Package Quantity: 10000; Tolerance: 20%; Voltage Rating (DC): 6.3V; Voltage Rating: 6.3V; Mount: Surface Mount; Max Operating Temperature: 85°C
C?#7 = CMP-2008-02842-2: General Purpose Ceramic Capacitor, 0402, 100nF, 10%, X5R, 15%, 16V; Dissipation Factor: 3.5%; Case Code (Metric): 1005; Packaging: Tape and Reel; Voltage Rating: 16V; Voltage: 16V; REACH SVHC: No SVHC; Width: 0.02inch; Thickness: 0.022inch; Max Operating Temperature: 85°C; Dielectric: X5R; Mount: Surface Mount; Package Quantity: 1; Length: 1mm; Termination: SMD/SMT; Voltage Rating (DC): 16V; Construction: Flat; Contact Plating: Tin; Depth: 0.5mm; Tolerance: 10%; RoHS Compliant: Yes; Min Operating Temperature: -55°C; Case Code (Imperial): 0402; Capacitance: 100nF; Height: 0.56mm; Case/Package: 0402; Radiation Hardening: No; Lead Free: Lead Free; Series: -
IC500 = MAX77542AAWU+: Integrated Circuit; Manufacturer_Name: Analog Devices; Datasheet Link: https://www.analog.com/MAX77542/datasheet; Height: 0.69mm; Manufacturer_Part_Number: MAX77542AAWU+
IC?#1 = RT9081AGQZA_2_: Integrated Circuit; Manufacturer_Name: RICHTEK; Manufacturer_Part_Number: RT9081AGQZA(2); Datasheet Link: https://componentsearchengine.com/Datasheets/2/RT9081AGQZA(2).pdf; Height: 0.32mm
IC?#2 = RT9081A-10GQZA: Integrated Circuit; Manufacturer_Name: RICHTEK; Datasheet Link: https://datasheet.datasheetarchive.com/originals/distributors/DKDS-18/355839.pdf; Height: 0.32mm; Manufacturer_Part_Number: RT9081A-10GQZA; Mouser Part Number: 835-RT9081A-10GQZA; Mouser Price/Stock: https://www.mouser.co.uk/ProductDetail/Richtek/RT9081A-10GQZA?qs=P%2FxahI%252BVehnQcAK2RIexiw%3D%3D
L500-L503 = CMP-06042-001570-1: Shielded Wirewound Inductor 0.47uH 20% 4900mA 0.023Ω 1008 (2520); Current Rating: 4.9A; Inductance: 470nH; DC Resistance (DCR): 23mR; Core Material: Ferrite; Saturation Current: 7.4A; Test Frequency: 1MHz; Value: 470nH; Height - Seated (Max): 0.047inch; Case Code (Imperial): 1008; Packaging: Cut Tape; Min Operating Temperature: -40°C; Max Operating Temperature: 125°C; Tolerance: 20%; Length: 0.098inch; Width: 0.079inch; Mount: Surface Mount; Case Code (Metric): 2520; Shielding: Shielded; Case/Package: 1008
R?#1 = CMP-2000-03293-2: RES Thick Film, 3kΩ, 1%, 0.1W, 100ppm/°C, 0603; Voltage Rating: 75V; Resistance: 3kR; Power Rating: 100mW; Features: Automotive AEC-Q200; Radiation Hardening: No; Contact Plating: Tin; Termination: SMD/SMT; Lead Free: Lead Free; Case Code (Imperial): 0603; Case Code (Metric): 1608; Case/Package: 0603; Depth: 0.85mm; Mount: Surface Mount; Voltage Rating (DC): 75V; Tolerance: 1%; Package Quantity: 10; Temperature Coefficient: 100ppm/°C; Height: 0.45mm; Max Power Dissipation: 100mW; Composition: Thick Film; Max Operating Temperature: 155°C; Military Standard: Not; Weight: 7.1E-05oz; Length: 1.55mm; Packaging: Tape and Reel; Number of Terminations: 2; Width: 0.85mm; Min Operating Temperature: -55°C
R?#2 = CMP-03211-005809-1: CRGP1206 1.2KΩ 0.5W ±100ppm/°C 1% 200V; Manufacturer: TE; Tolerance: 0.01; Temperature Range High: +155°C; Temperature Coefficient: ±100ppm/°C; Lead Free: Yes; Device Class L2: Resistors; Resistance: 1.2KΩ; Voltage Rating: 200V; Power Rating: 0.5W; Automotive: No; RoHS: TRUE; Ipc Land Pattern Name: RESC310155X55; Category: Res; Manufacturer Part Number: CRGP1206F1K2; Series: CRGP; ComponentLink2Description: Datasheet; Value: 1.2KΩ; Octopart: https://octopart.com/crgp1206f1k2-te+connectivity-91018858; Temperature Range Low: -55°C; Package: CRGP1206; Device Class L1: Passive Components; Device Class L3: Chip SMD Resistors; Composition: Thick Film; Height: 0.65mm; Ambient Temperature Range High: +70°C; ComponentLink2URL: https://www.mouser.com/datasheet/2/418/NG_DS_9-1773463-9_A-1358566.pdf; Temperature: -55°C to +155°C
R?#3 = CMP-2005-03750-1: Manufacturer: Panasonic; Part Number: ERJ-P14J562U
R?#4 = CMP-2005-03668-1: Manufacturer: Panasonic; Part Number: ERJ-P14J162U
R?#5 = CMP-2001-00686-1: Manufacturer: Panasonic; Part Number: ERA-6AED222V
R?#6 = CMP-2005-03724-1: Manufacturer: Panasonic; Part Number: ERJ-P14J392U
R?#7 = CMP-2001-00796-1: Manufacturer: Panasonic; Part Number: ERA6AEB3092V
R?#8 = CMP-2002-01029-1: Manufacturer: Panasonic; Part Number: ERJ-2RKF6492X
R?#9 R?#10 = CMP-2002-07343-1: Manufacturer: Yageo / Phycomp; Part Number: RC0402FR-07100KL
U?#1 U?#2 = CMP-12756-000022-1: IC REG LIN POS ADJ 300MA SOT25; Manufacturer: Diodes Inc.; Dropout Voltage: 300mV; Nominal Supply Current: 55-65uA; Standoff Height: 0.013mm; Output Voltage: 0.8-5V; Min Supply Voltage: 2V; Number Of Outputs: 1; Max Supply Voltage: 6V; Output Type: AdjustableProgrammable; Accuracy Percentage: 2%; Max Junction Temp: +150°C; Max Power Dissipation: 640mW; RoHS: TRUE; ComponentLink2URL: https://www.diodes.com/assets/Datasheets/AP7331.pdf; Package: SOT25; Category: IC; Temperature Range Low: -40°C; ComponentLink2Description: Datasheet; Automotive: No; Device Class L3: Voltage Regulators - Linear; Mouser Description: AP7331 Series 0.8 - 5 V ADJ Output 300 mA LDO Linear Regulator - SOT-25; Device Class L2: Power Management ICs; Temperature Range High: +125°C; Lead Free: Yes; Footprint Url: https://www.diodes.com/assets/Package-Files/SOT25.pdf; Manufacturer Part Number: AP7331-WG-7; Device Class L1: Integrated Circuits (ICs); Octopart: https://octopart.com/ap7331-wg-7-diodes+inc.-17930424; Ambient Temperature Range Low: -40°C; Output Current: 300mA; Height: 1.4mm; Ambient Temperature Range High: +85°C; Temperature: -40°C to +125°C; Digikey Description: IC REG LIN POS ADJ 300MA SOT25

## Sheet rf_power.SchDoc
size 381 x 241 mm; SheetNumber: 2; SheetTotal: 17
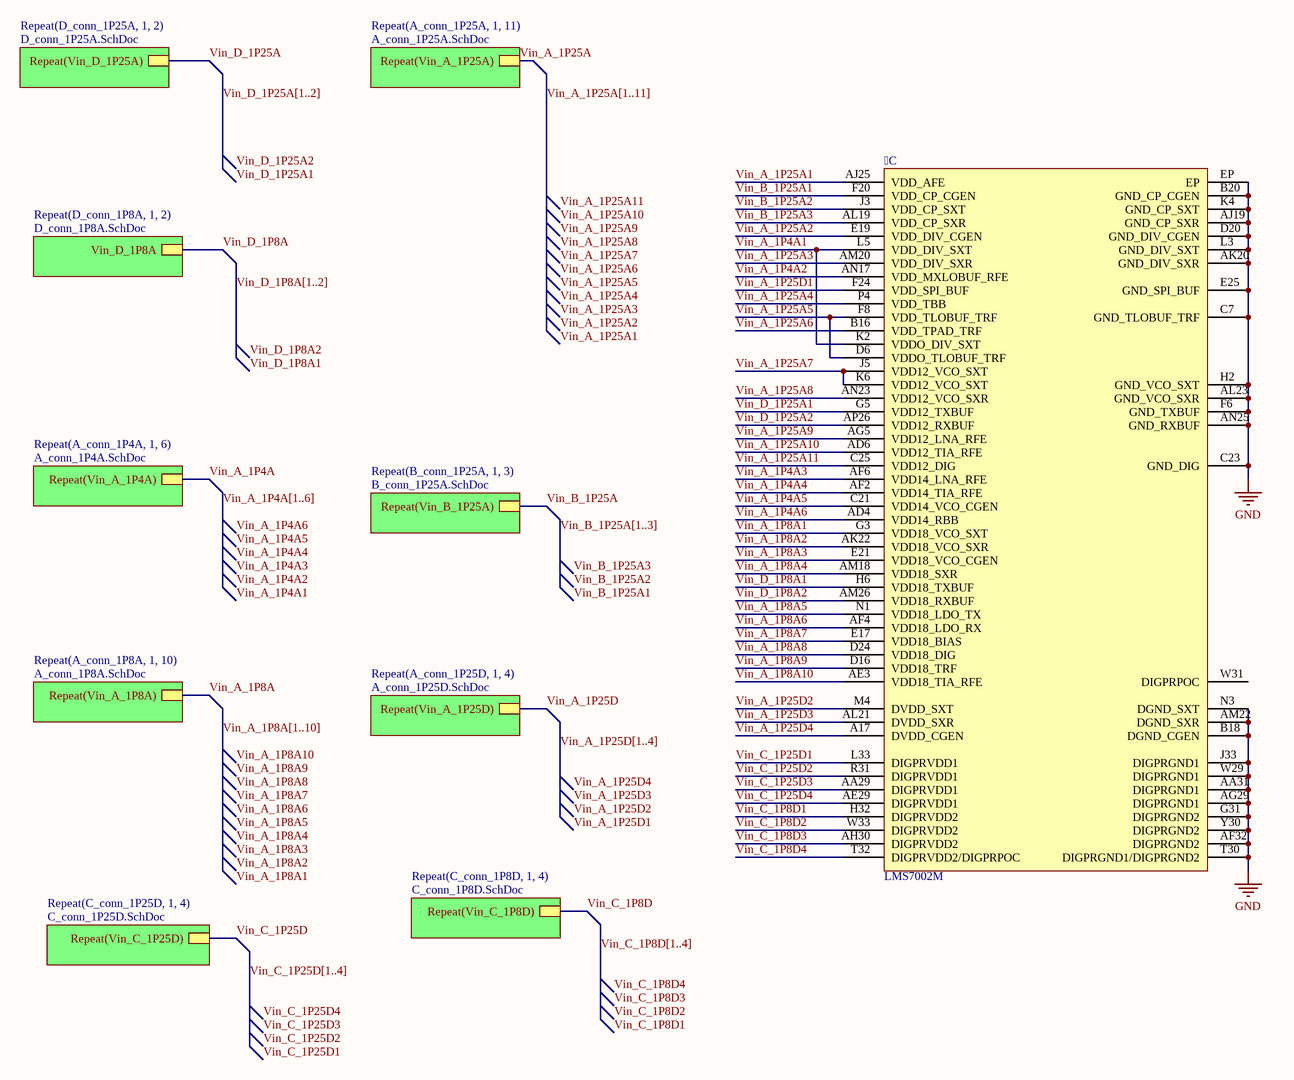
[diagram p7: rf_power.SchDoc]

### Parts
  LMS7002M  [LM-QFN-261_V]  (part C of 4)

### Sub-sheets
Repeat(A_conn_1P4A, 1, 6) = A_conn_1P4A.SchDoc: Repeat(Vin_A_1P4A)
Repeat(A_conn_1P8A, 1, 10) = A_conn_1P8A.SchDoc: Repeat(Vin_A_1P8A)
Repeat(A_conn_1P25A, 1, 11) = A_conn_1P25A.SchDoc: Repeat(Vin_A_1P25A)
Repeat(A_conn_1P25D, 1, 4) = A_conn_1P25D.SchDoc: Repeat(Vin_A_1P25D)
Repeat(B_conn_1P25A, 1, 3) = B_conn_1P25A.SchDoc: Repeat(Vin_B_1P25A)
Repeat(C_conn_1P8D, 1, 4) = C_conn_1P8D.SchDoc: Repeat(Vin_C_1P8D)
Repeat(C_conn_1P25D, 1, 4) = C_conn_1P25D.SchDoc: Repeat(Vin_C_1P25D)
Repeat(D_conn_1P8A, 1, 2) = D_conn_1P8A.SchDoc: Vin_D_1P8A
Repeat(D_conn_1P25A, 1, 2) = D_conn_1P25A.SchDoc: Repeat(Vin_D_1P25A)

### Nets
GND: .AA31(DIGPRGND1) .AF32(DIGPRGND2) .AG29(DIGPRGND1) .AJ19(GND_CP_SXR) .AK20(GND_DIV_SXR) .AL23(GND_VCO_SXR) .AM22(DGND_SXR) .AN25(GND_RXBUF) .B18(DGND_CGEN) .B20(GND_CP_CGEN) .C7(GND_TLOBUF_TRF) .C23(GND_DIG) .D20(GND_DIV_CGEN) .E25(GND_SPI_BUF) .EP .F6(GND_TXBUF) .G31(DIGPRGND2) .H2(GND_VCO_SXT) .J33(DIGPRGND1) .K4(GND_CP_SXT) .L3(GND_DIV_SXT) .N3(DGND_SXT) .T30(DIGPRGND1/DIGPRGND2) .W29(DIGPRGND1) .Y30(DIGPRGND2)
Vin_B_1P25A1: .AL19(VDD_CP_SXR) .F20(VDD_CP_CGEN) .J3(VDD_CP_SXT)  [also labelled Vin_B_1P25A2, Vin_B_1P25A3]  [project net Vin_B_1P25A]
Vin_C_1P8D1: .AH30(DIGPRVDD2) .H32(DIGPRVDD2) .T32(DIGPRVDD2/DIGPRPOC) .W33(DIGPRVDD2)  [also labelled Vin_C_1P8D2, Vin_C_1P8D3, Vin_C_1P8D4]  [project net Vin_C_1P8D]
Vin_C_1P25D1: .AA29(DIGPRVDD1) .AE29(DIGPRVDD1) .L33(DIGPRVDD1) .R31(DIGPRVDD1)  [also labelled Vin_C_1P25D2, Vin_C_1P25D3, Vin_C_1P25D4]  [project net Vin_C_1P25D]
Vin_A_1P4A: sheet Repeat(A_conn_1P4A, 1, 6)/Repeat(Vin_A_1P4A)
Vin_A_1P4A1: .K2(VDDO_DIV_SXT) .L5(VDD_DIV_SXT)  [project net Vin_A_1P4A]
Vin_A_1P4A2: .AN17(VDD_MXLOBUF_RFE)  [project net Vin_A_1P4A]
Vin_A_1P4A3: .AF6(VDD14_LNA_RFE)  [project net Vin_A_1P4A]
Vin_A_1P4A4: .AF2(VDD14_TIA_RFE)  [project net Vin_A_1P4A]
Vin_A_1P4A5: .C21(VDD14_VCO_CGEN)  [project net Vin_A_1P4A]
Vin_A_1P4A6: .AD4(VDD14_RBB)  [project net Vin_A_1P4A]
Vin_A_1P8A: sheet Repeat(A_conn_1P8A, 1, 10)/Repeat(Vin_A_1P8A)
Vin_A_1P8A1: .G3(VDD18_VCO_SXT)  [project net Vin_A_1P8A]
Vin_A_1P8A2: .AK22(VDD18_VCO_SXR)  [project net Vin_A_1P8A]
Vin_A_1P8A3: .E21(VDD18_VCO_CGEN)  [project net Vin_A_1P8A]
Vin_A_1P8A4: .AM18(VDD18_SXR)  [project net Vin_A_1P8A]
Vin_A_1P8A5: .N1(VDD18_LDO_TX)  [project net Vin_A_1P8A]
Vin_A_1P8A6: .AF4(VDD18_LDO_RX)  [project net Vin_A_1P8A]
Vin_A_1P8A7: .E17(VDD18_BIAS)  [project net Vin_A_1P8A]
Vin_A_1P8A8: .D24(VDD18_DIG)  [project net Vin_A_1P8A]
Vin_A_1P8A9: .D16(VDD18_TRF)  [project net Vin_A_1P8A]
Vin_A_1P8A10: .AE3(VDD18_TIA_RFE)  [project net Vin_A_1P8A]
Vin_A_1P25A: sheet Repeat(A_conn_1P25A, 1, 11)/Repeat(Vin_A_1P25A)
Vin_A_1P25A1: .AJ25(VDD_AFE)  [project net Vin_A_1P25A]
Vin_A_1P25A2: .E19(VDD_DIV_CGEN)  [project net Vin_A_1P25A]
Vin_A_1P25A3: .AM20(VDD_DIV_SXR)  [project net Vin_A_1P25A]
Vin_A_1P25A4: .P4(VDD_TBB)  [project net Vin_A_1P25A]
Vin_A_1P25A5: .D6(VDDO_TLOBUF_TRF) .F8(VDD_TLOBUF_TRF)  [project net Vin_A_1P25A]
Vin_A_1P25A6: .B16(VDD_TPAD_TRF)  [project net Vin_A_1P25A]
Vin_A_1P25A7: .J5(VDD12_VCO_SXT) .K6(VDD12_VCO_SXT)  [project net Vin_A_1P25A]
Vin_A_1P25A8: .AN23(VDD12_VCO_SXR)  [project net Vin_A_1P25A]
Vin_A_1P25A9: .AG5(VDD12_LNA_RFE)  [project net Vin_A_1P25A]
Vin_A_1P25A10: .AD6(VDD12_TIA_RFE)  [project net Vin_A_1P25A]
Vin_A_1P25A11: .C25(VDD12_DIG)  [project net Vin_A_1P25A]
Vin_A_1P25D: sheet Repeat(A_conn_1P25D, 1, 4)/Repeat(Vin_A_1P25D)
Vin_A_1P25D1: .F24(VDD_SPI_BUF)  [project net Vin_A_1P25D]
Vin_A_1P25D2: .M4(DVDD_SXT)  [project net Vin_A_1P25D]
Vin_A_1P25D3: .AL21(DVDD_SXR)  [project net Vin_A_1P25D]
Vin_A_1P25D4: .A17(DVDD_CGEN)  [project net Vin_A_1P25D]
Vin_B_1P25A: sheet Repeat(B_conn_1P25A, 1, 3)/Repeat(Vin_B_1P25A)
Vin_C_1P8D: sheet Repeat(C_conn_1P8D, 1, 4)/Repeat(Vin_C_1P8D)
Vin_C_1P25D: sheet Repeat(C_conn_1P25D, 1, 4)/Repeat(Vin_C_1P25D)
Vin_D_1P8A1: .H6(VDD18_TXBUF)
Vin_D_1P8A2: .AM26(VDD18_RXBUF)
Vin_D_1P25A: sheet Repeat(D_conn_1P25A, 1, 2)/Repeat(Vin_D_1P25A)
Vin_D_1P25A1: .G5(VDD12_TXBUF)  [project net Vin_D_1P25A]
Vin_D_1P25A2: .AP26(VDD12_RXBUF)  [project net Vin_D_1P25A]

Not connected (* = marked no-connect by the designer):  W31(DIGPRPOC)

### Buses and harness runs
bus Vin_A_1P4A[1..6]
bus Vin_A_1P8A[1..10]
bus Vin_A_1P25A[1..11]
bus Vin_A_1P25D[1..4]
bus Vin_B_1P25A[1..3]
bus Vin_C_1P8D[1..4]
bus Vin_C_1P25D[1..4]
bus Vin_D_1P8A[1..2]
bus Vin_D_1P25A[1..2]

### Notes on the sheet
- Labels drawn without touching a wire or pin: Vin_A_1P4A1, Vin_A_1P4A2, Vin_A_1P4A3, Vin_A_1P4A4, Vin_A_1P4A5, Vin_A_1P4A6, Vin_A_1P8A1, Vin_A_1P8A3, Vin_A_1P8A4, Vin_A_1P8A5, Vin_A_1P8A6, Vin_A_1P8A7, Vin_A_1P8A8, Vin_A_1P8A9, Vin_A_1P8A10, Vin_A_1P25A1, Vin_A_1P25A2, Vin_A_1P25A3, Vin_A_1P25A4, Vin_A_1P25A5, Vin_A_1P25A6, Vin_A_1P25A7, Vin_A_1P25A8, Vin_A_1P25A9, Vin_A_1P25A10, Vin_A_1P25A11, Vin_A_1P25D1, Vin_A_1P25D2, Vin_A_1P25D3, Vin_A_1P25D4, Vin_B_1P25A1, Vin_B_1P25A2, Vin_B_1P25A3, Vin_C_1P8D1, Vin_C_1P8D2, Vin_C_1P8D3, Vin_C_1P8D4, Vin_C_1P25D1, Vin_C_1P25D2, Vin_C_1P25D3, Vin_C_1P25D4, Vin_D_1P8A1, Vin_D_1P25A1

### Library data of the parts
 = CMP-2000-06561-1: FPRF MIMO Transceiver IC with Integrated Microcontroller, 1.1 to 1.89 V, -40 to 85 degC, 261-Pin QFN, RoHS; Manufacturer: LimeMicrosystemsLtd; Current - Receiving: 420mA; Protocol: CDMA,GSM,HSPA,LTE,TD-SCDMA,WCDMA; Frequency: 100kHz~3.8GHz; Current - Transmitting: 350mA; Memory Size: 10kBSRAM; Power - Output: 0dBm; Serial Interfaces: SPI; RF Family/Standard: Cellular; Voltage - Supply: 1.1V~1.89V; GPIO: -; Data Rate (Max): -; Family: RFTransceiverICs; Modulation: -; Mounting Technology: SurfaceMount; Datasheet URL: http://www.richardsonrfpd.com/resources/RellDocuments/SYS_31/LMS7002M.pdf; Package Description: 261-Pin Quad Flat No-lead Package, Body 11.5 x 11.5 mm, Pitch 0.666 mm; Series: -; Sensitivity: -; Category: RF/IFandRFID; Package Reference: QFN-261; Package / Case: 261-SMDModule; Package URL: http://cdn.limemicro.com/wp-content/uploads/2015/08/LMS7002M-PCB-Layout-Recommendations-1.0r5.pdf; Operating Temperature: -40°C~85°C; Manufacturer URL: http://www.limemicro.com/; Packaging: Tray; Datasheet Version: Rev. 2.8.0, 09/2015; Type: TxRx+MCU